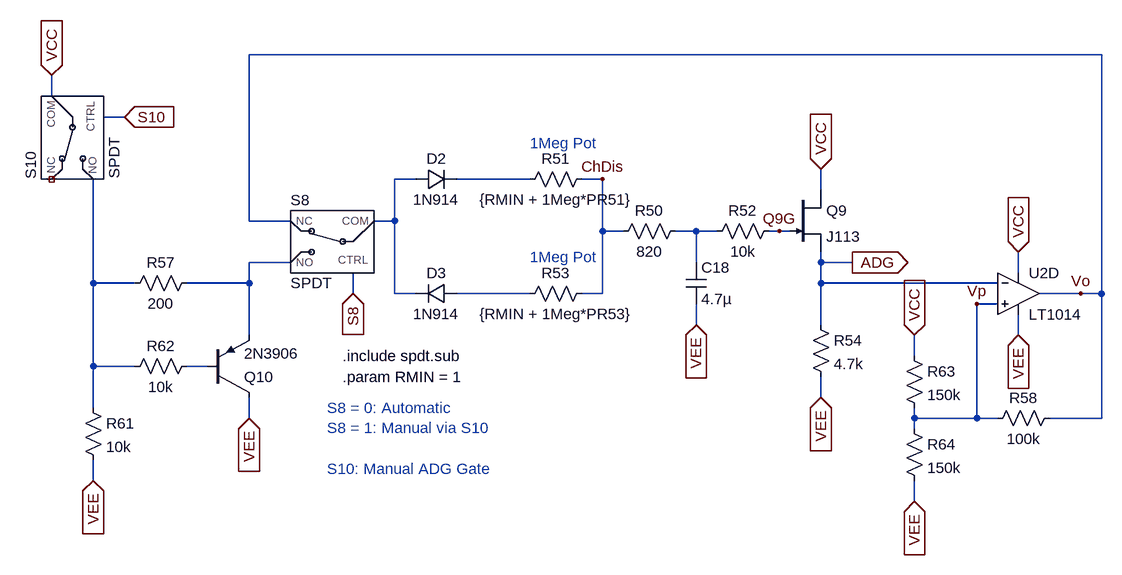
[diagram p0: schematic ADG.asc]
ADG.asc, the LTspice schematic file:
Version 4.1
SHEET 1 1576 980
WIRE 1568 -48 256 -48
WIRE -48 16 -48 -16
WIRE 64 48 32 48
WIRE 512 144 480 144
WIRE 688 144 576 144
WIRE 800 144 768 144
WIRE 1136 160 1136 128
WIRE 256 208 256 -48
WIRE 320 208 256 208
WIRE 480 208 480 144
WIRE 480 208 448 208
WIRE 800 224 800 144
WIRE 832 224 800 224
WIRE 944 224 912 224
WIRE 976 224 944 224
WIRE 1072 224 1056 224
WIRE 1088 224 1072 224
WIRE 320 272 256 272
WIRE 944 272 944 224
WIRE 1136 272 1136 256
WIRE 1184 272 1136 272
WIRE 1440 288 1440 256
WIRE 16 304 16 144
WIRE 80 304 16 304
WIRE 256 304 256 272
WIRE 256 304 160 304
WIRE 1136 304 1136 272
WIRE 1408 304 1136 304
WIRE 416 320 416 288
WIRE 480 320 480 208
WIRE 512 320 480 320
WIRE 688 320 576 320
WIRE 800 320 800 224
WIRE 800 320 768 320
WIRE 1536 320 1472 320
WIRE 1568 320 1568 -48
WIRE 1568 320 1536 320
WIRE 1408 336 1376 336
WIRE 944 368 944 336
WIRE 1136 368 1136 304
WIRE 256 384 256 304
WIRE 1440 384 1440 352
WIRE 1280 416 1280 384
WIRE 16 432 16 304
WIRE 80 432 16 432
WIRE 192 432 160 432
WIRE 1136 480 1136 448
WIRE 16 496 16 432
WIRE 256 512 256 480
WIRE 1280 512 1280 496
WIRE 1376 512 1376 336
WIRE 1376 512 1280 512
WIRE 1408 512 1376 512
WIRE 1568 512 1568 320
WIRE 1568 512 1488 512
WIRE 1280 528 1280 512
WIRE 16 608 16 576
WIRE 1280 640 1280 608
FLAG -48 -16 VCC
IOPIN -48 -16 In
FLAG 16 608 VEE
IOPIN 16 608 In
FLAG 256 512 VEE
IOPIN 256 512 In
FLAG 64 48 S10
IOPIN 64 48 In
FLAG 416 320 S8
IOPIN 416 320 In
FLAG 944 368 VEE
IOPIN 944 368 In
FLAG 1136 128 VCC
IOPIN 1136 128 In
FLAG 1136 480 VEE
IOPIN 1136 480 In
FLAG 1440 256 VCC
IOPIN 1440 256 In
FLAG 1440 384 VEE
IOPIN 1440 384 In
FLAG 1184 272 ADG
IOPIN 1184 272 Out
FLAG 1280 384 VCC
IOPIN 1280 384 In
FLAG 1280 640 VEE
IOPIN 1280 640 In
FLAG 1072 224 Q9G
FLAG 1376 336 Vp
FLAG 1536 320 Vo
FLAG 800 144 ChDis
SYMBOL njf 1088 160 R0
SYMATTR InstName Q9
SYMATTR Value J113
SYMBOL res 0 480 R0
SYMATTR InstName R61
SYMATTR Value 10k
SYMBOL res 176 416 R90
WINDOW 0 0 56 VBottom 2
WINDOW 3 32 56 VTop 2
SYMATTR InstName R62
SYMATTR Value 10k
SYMBOL res 176 288 R90
WINDOW 0 0 56 VBottom 2
WINDOW 3 32 56 VTop 2
SYMATTR InstName R57
SYMATTR Value 200
SYMBOL pnp 192 480 M180
SYMATTR InstName Q10
SYMATTR Value 2N3906
SYMBOL diode 512 160 R270
WINDOW 0 32 32 VTop 2
WINDOW 3 0 32 VBottom 2
SYMATTR InstName D2
SYMATTR Value 1N914
SYMBOL diode 576 304 R90
WINDOW 0 0 32 VBottom 2
WINDOW 3 32 32 VTop 2
SYMATTR InstName D3
SYMATTR Value 1N914
SYMBOL res 784 128 R90
WINDOW 0 0 56 VBottom 2
WINDOW 3 32 56 VTop 2
SYMATTR InstName R51
SYMATTR Value {RMIN + 1Meg*PR51}
SYMBOL res 784 304 R90
WINDOW 0 0 56 VBottom 2
WINDOW 3 32 56 VTop 2
SYMATTR InstName R53
SYMATTR Value {RMIN + 1Meg*PR53}
SYMBOL res 928 208 R90
WINDOW 0 0 56 VBottom 2
WINDOW 3 32 56 VTop 2
SYMATTR InstName R50
SYMATTR Value 820
SYMBOL res 1072 208 R90
WINDOW 0 0 56 VBottom 2
WINDOW 3 32 56 VTop 2
SYMATTR InstName R52
SYMATTR Value 10k
SYMBOL cap 928 272 R0
SYMATTR InstName C18
SYMATTR Value 4.7µ
SYMBOL res 1120 352 R0
SYMATTR InstName R54
SYMATTR Value 4.7k
SYMBOL OpAmps\\LT1014 1440 256 R0
SYMATTR InstName U2D
SYMBOL res 1264 400 R0
SYMATTR InstName R63
SYMATTR Value 150k
SYMBOL res 1264 512 R0
SYMATTR InstName R64
SYMATTR Value 150k
SYMBOL res 1504 496 R90
WINDOW 0 0 56 VBottom 2
WINDOW 3 32 56 VTop 2
SYMATTR InstName R58
SYMATTR Value 100k
SYMBOL spdt -16 48 R270
SYMATTR InstName S10
SYMBOL spdt 416 240 R0
SYMATTR InstName S8
TEXT 400 416 Left 2 !.include spdt.sub
TEXT 376 496 Left 2 ;S8 = 0: Automatic\nS8 = 1: Manual via S10\n \nS10: Manual ADG Gate
TEXT 688 88 Left 2 ;1Meg Pot
TEXT 688 264 Left 2 ;1Meg Pot
TEXT 400 448 Left 2 !.param RMIN = 1

The netlist it stands for:
* ADG.asc
J§Q9 VCC Q9G ADG J113
R61 N005 VEE 10k
R62 N007 N005 10k
R57 N004 N005 200
Q10 VEE N007 N004 0 2N3906
D2 N001 N002 1N914
D3 N006 N001 1N914
R51 ChDis N002 {RMIN + 1Meg*PR51}
R53 ChDis N006 {RMIN + 1Meg*PR53}
R50 N003 ChDis 820
R52 Q9G N003 10k
C18 N003 VEE 4.7µ
R54 ADG VEE 4.7k
X§U2D Vp ADG VCC VEE Vo LT1014  ; pins In+ In- V+ V- OUT
R63 VCC Vp 150k
R64 Vp VEE 150k
R58 Vo Vp 100k
X§S10 VCC N005 NC_01 S10 SPDT  ; pins COM NO NC CTRL
X§S8 N001 N004 Vo S8 SPDT  ; pins COM NO NC CTRL
.model D D
.lib standard.dio
.model NPN NPN
.model PNP PNP
.lib standard.bjt
.model NJF NJF
.model PJF PJF
.lib standard.jft
.include spdt.sub
* S8 = 0: Automatic
* S8 = 1: Manual via S10
* S10: Manual ADG Gate
* 1Meg Pot
* 1Meg Pot
.param RMIN = 1
.backanno
.end